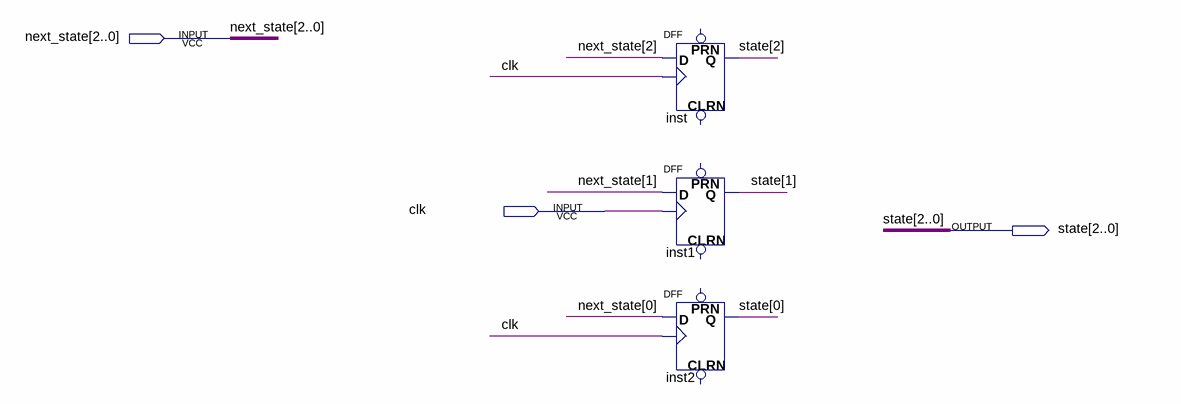
[diagram p0: schematic sheet]
// Quartus schematic state_register.bdf as structural Verilog: 3 symbols, 3 pins
module state_register (
  input  [2:0] next_state,
  input  clk,
  output [2:0] state
);

  DFF inst (.CLK(clk), .D(next_state[2]), .Q(state[2]));  // open: CLRN, PRN
  DFF inst1 (.CLK(clk), .D(next_state[1]), .Q(state[1]));  // open: CLRN, PRN
  DFF inst2 (.CLK(clk), .D(next_state[0]), .Q(state[0]));  // open: CLRN, PRN
endmodule
